# Altium schematic sheet connectors.SchDoc: Test
size A4; DrawnBy: Łukasz Przeniosło; Organization: Apptimia sp. z o.o.; Address1: Wojska Polskiego 184c/4; Address2: 71-256 Szczecin; Address3: www.apptimia.com; DocumentNumber: 2; Revision: 1; SheetNumber: 2; SheetTotal: 12
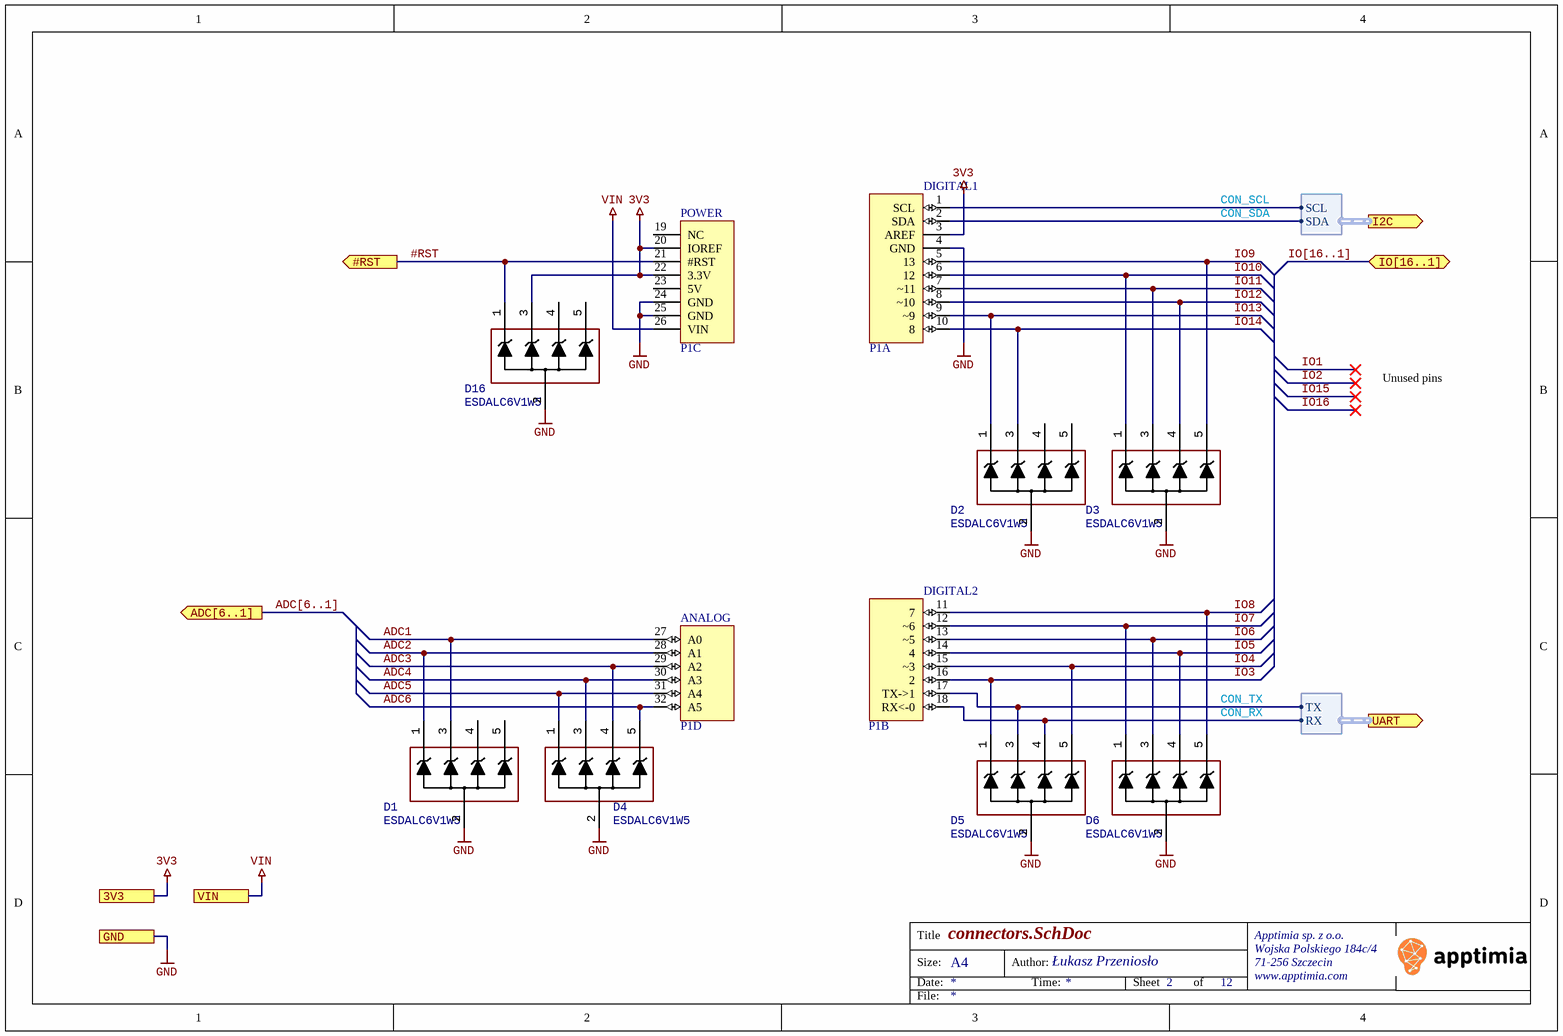
[diagram p0: connectors.SchDoc]

## Parts
D1  ESDALC6V1W5  [SOT323-5L]
D2  ESDALC6V1W5  [SOT323-5L]
D3  ESDALC6V1W5  [SOT323-5L]
D4  ESDALC6V1W5  [SOT323-5L]
D5  ESDALC6V1W5  [SOT323-5L]
D6  ESDALC6V1W5  [SOT323-5L]
D16  ESDALC6V1W5  [SOT323-5L]
P1  NUCLEO-CAPE  [ARDUINO_UNO_HEADER_NOSPI]  (value not drawn)  (parts A,B,C,D of 4)

## Ports
3V3, #RST (out), ADC[6..1] (out), GND, I2C (out, harness I2C), IO[16..1] (bidir), UART (out, harness UART), VIN

## Harnesses
I2C: SCL, SDA
UART: TX, RX

## Nets
3V3: D16.3 P1.3(AREF) P1.20(IOREF) P1.22(3.3V) ; port 3V3
GND: D1.2 D2.2 D3.2 D4.2 D5.2 D6.2 D16.2 P1.4(GND) P1.24(GND) P1.25(GND) ; port GND
VIN: P1.26(VIN) ; port VIN
#RST: D16.1 P1.21(#RST) ; port #RST
ADC1: D1.3 P1.27(A0)
ADC2: D1.1 P1.28(A1)
ADC3: D4.4 P1.29(A2)
ADC4: D4.3 P1.30(A3)
ADC5: D4.1 P1.31(A4)
ADC6: D4.5 P1.32(A5)
CON_RX: D5.4 P1.18(RX<-0) ; port UART.RX
CON_SCL: P1.1(SCL) ; port I2C.SCL
CON_SDA: P1.2(SDA) ; port I2C.SDA
CON_TX: D5.3 P1.17(TX->1) ; port UART.TX
IO3: D5.1 P1.16(2)
IO4: D5.5 P1.15(~3)
IO5: D6.4 P1.14(4)
IO6: D6.3 P1.13(~5)
IO7: D6.1 P1.12(~6)
IO8: D6.5 P1.11(7)
IO9: D3.5 P1.5(13)
IO10: D3.1 P1.6(12)
IO11: D3.3 P1.7(~11)
IO12: D3.4 P1.8(~10)
IO13: D2.1 P1.9(~9)
IO14: D2.3 P1.10(8)

Not connected (* = marked no-connect by the designer): D1 4 5; D2 4 5; D16 4 5; P1 19(NC) 23(5V)

## Buses and harness runs
bus ADC[6..1] = port ADC[6..1]
bus IO[16..1] = port IO[16..1]

## Notes on the sheet
- Unused pins
- Title
- Size:
- Date:
- A4
- Author:
- Time:
- Sheet
- of
- File:
- (in symbol Nucleo-headers, part A) DIGITAL1
- (in symbol Nucleo-headers, part B) DIGITAL2
- (in symbol Nucleo-headers, part C) POWER
- (in symbol Nucleo-headers, part D) ANALOG

## Library data of the parts
P1 = Nucleo-headers: Arduino header
D1-D6 D16 = ESDALC6V1W5: manid: ESDALC6V1W5